# EAGLE design bazz_fuss (EAGLE 5.07)
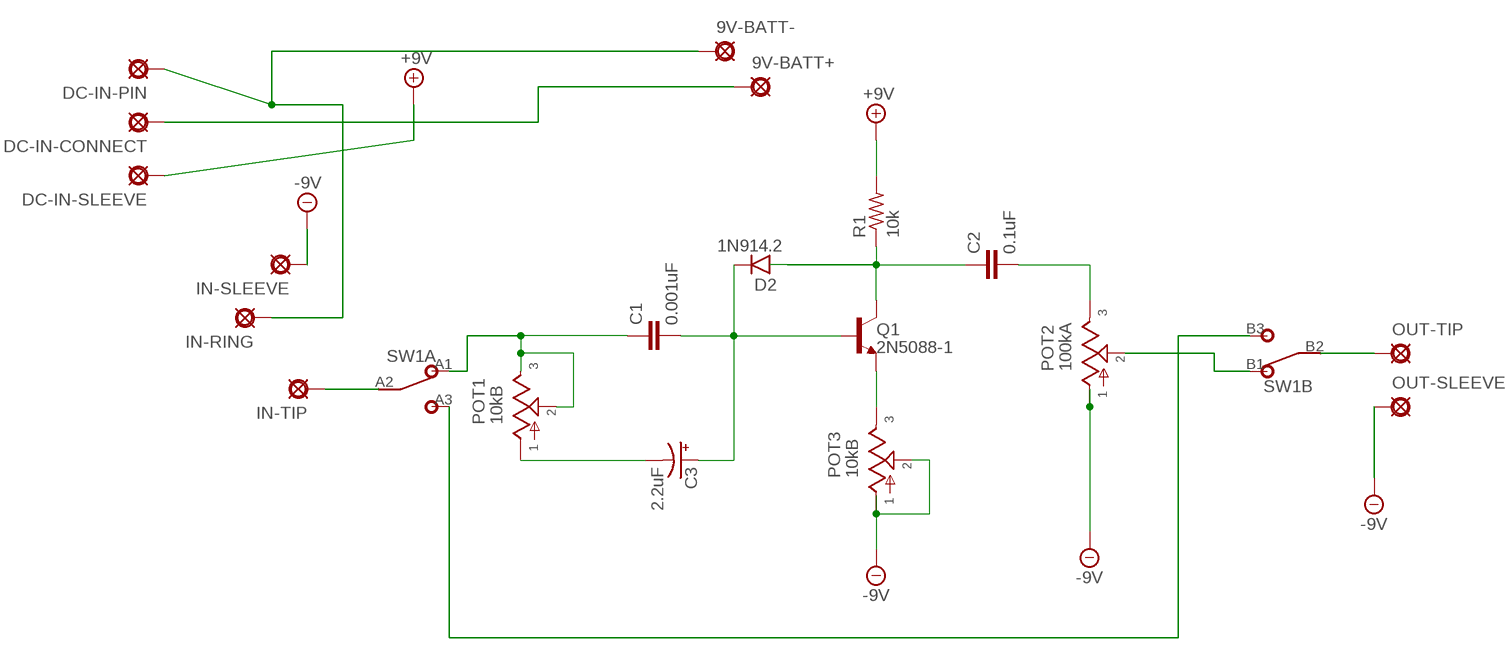
[diagram p0: schematic, sheet 1]

## Parts
9V-BATT+  PAD  [SQUARE]
9V-BATT-  PAD8  [OCTOGON]
C1  0.001uF  070X0302  [070X030]
C2  0.1uF  072X0252  [072X025]
C3  2.2uF  0502  [050_020_2]
D2  1N914.2  [DO35-2]
DC-IN-CONNECT  PAD  [SQUARE]
DC-IN-PIN  PAD8  [OCTOGON]
DC-IN-SLEEVE  PAD  [SQUARE]
IN-RING  PAD  [SQUARE]
IN-SLEEVE  PAD8  [OCTOGON]
IN-TIP  PAD  [SQUARE]
OUT-SLEEVE  PAD8  [OCTOGON]
OUT-TIP  PAD  [SQUARE]
POT1  10kB  POT  [POT]
POT2  100kA  POT  [POT]
POT3  10kB  POT  [POT]
Q1  2N5088-1  [TO92-]
R1  10k  3MM.3  [R0204/3]
SW1  DPDT  [DPDT]

## Nets
+9V: DC-IN-SLEEVE.1(PAD) R1.2
-9V: IN-SLEEVE.1(PAD) OUT-SLEEVE.1(PAD) POT2.1 POT3.1 POT3.2
N$2: C1.2 C3.+ D2.C Q1.2(B)
N$3: POT3.3 Q1.3(E)
N$4: POT2.2 SW1.B1
N$5: C1.1 POT1.2 POT1.3 SW1.A1
N$6: C3.- POT1.1
N$7: C2.2 POT2.3
N$8: IN-TIP.1(PAD) SW1.A2
N$11: 9V-BATT+.1(PAD) DC-IN-CONNECT.1(PAD)
N$12: OUT-TIP.1(PAD) SW1.B2
N$13: SW1.A3 SW1.B3
N$16: 9V-BATT-.1(PAD) DC-IN-PIN.1(PAD) IN-RING.1(PAD)
N$18: C2.1 D2.A Q1.1(C) R1.1

## Library data of the parts
9V-BATT+ 9V-BATT- DC-IN-CONNECT DC-IN-PIN DC-IN-SLEEVE IN-RING IN-SLEEVE IN-TIP OUT-SLEEVE OUT-TIP = gm-supply:PAD: PAD use this package for pads with any purpose, including input, output, send or return various pad shapes: round, square, octogonal, long, and long offset
C1 = gm-caps-film-chicklet:070X030: 0.0001 - .01uF (100 - 10,000pF) Panasonic ECQ-B 7mm x 3mm 50 or 63V: 0.0001 - .01uF (100 - 10,000pF);
C2 = gm-caps-film-box:072X025: 1000pF - 0.47uF WIMA MKP2 63, 100V: 1000pF - 0.015uF; MKS2 50V: 0.33 - 0.47uF; 63V: 1000pF - 0.22uF;
C3 = gm-caps-electro-pol:050: 0.22 - 100uF Xicon values at Mouser.com: 10V: 10 - 100uF; 16V: 2.2 - 47uF; 25V: 0.47 - 47uF; 50V: 0.22 - 22uF
D2 = gm-diodes:1N914: Fast Switching Diode DO-35 glass case a.k.a. 1N4148
POT1-POT3 = gm-pots:POT: Potentiometers the arrow indicates the clockwise motion of th wiper (lug 2) fully counter clockwise there is no resistance between lugs 1 and 2 fully clockwise the resistance between lugs 1 and 2 is the value of the pot
Q1 = gm-trans:2N5088: NPN Transistor
R1 = gm-resistors:3MM: 3mm Resistors Leads spaced 1-6 holes apart for 0.1" perfboard. Suitable for 1/8 watt resistors.
SW1 = gm-switches:DPDT

## Board
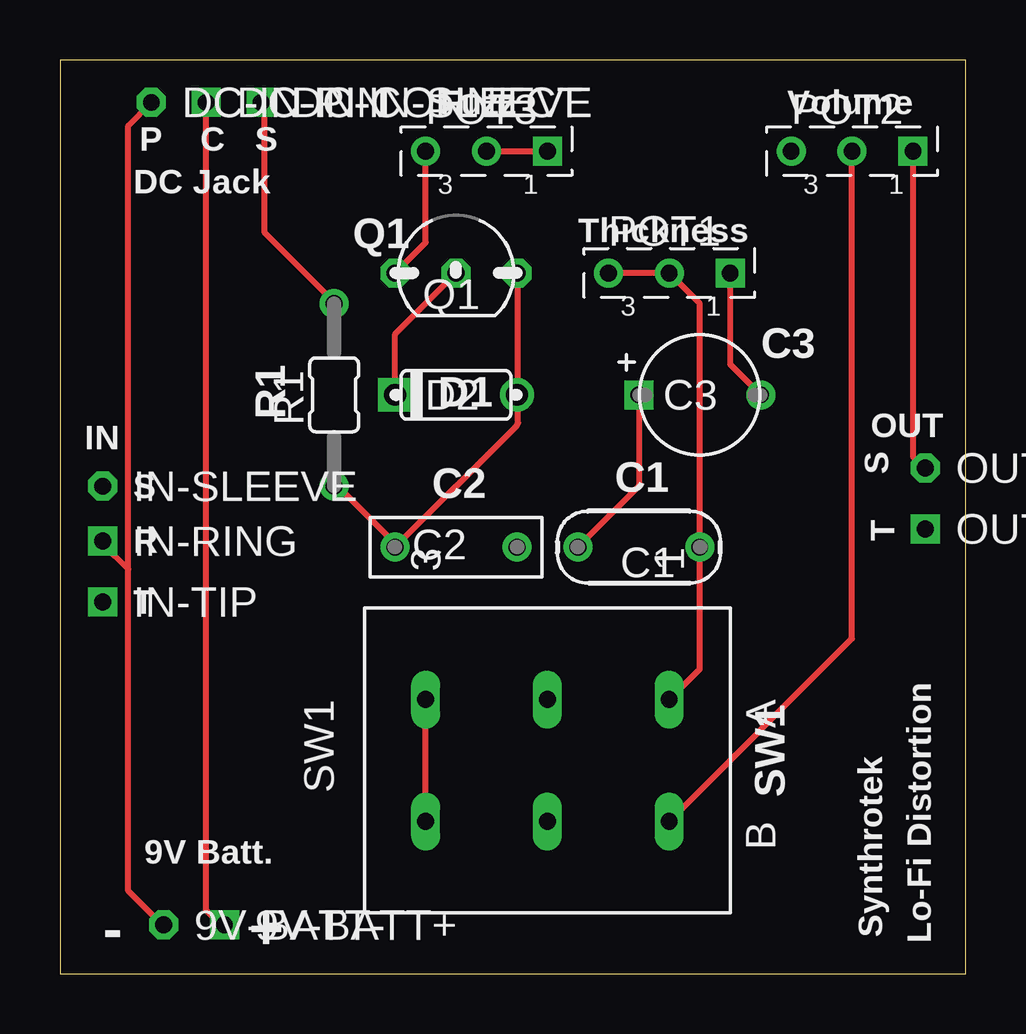
[diagram p1: board, top side]
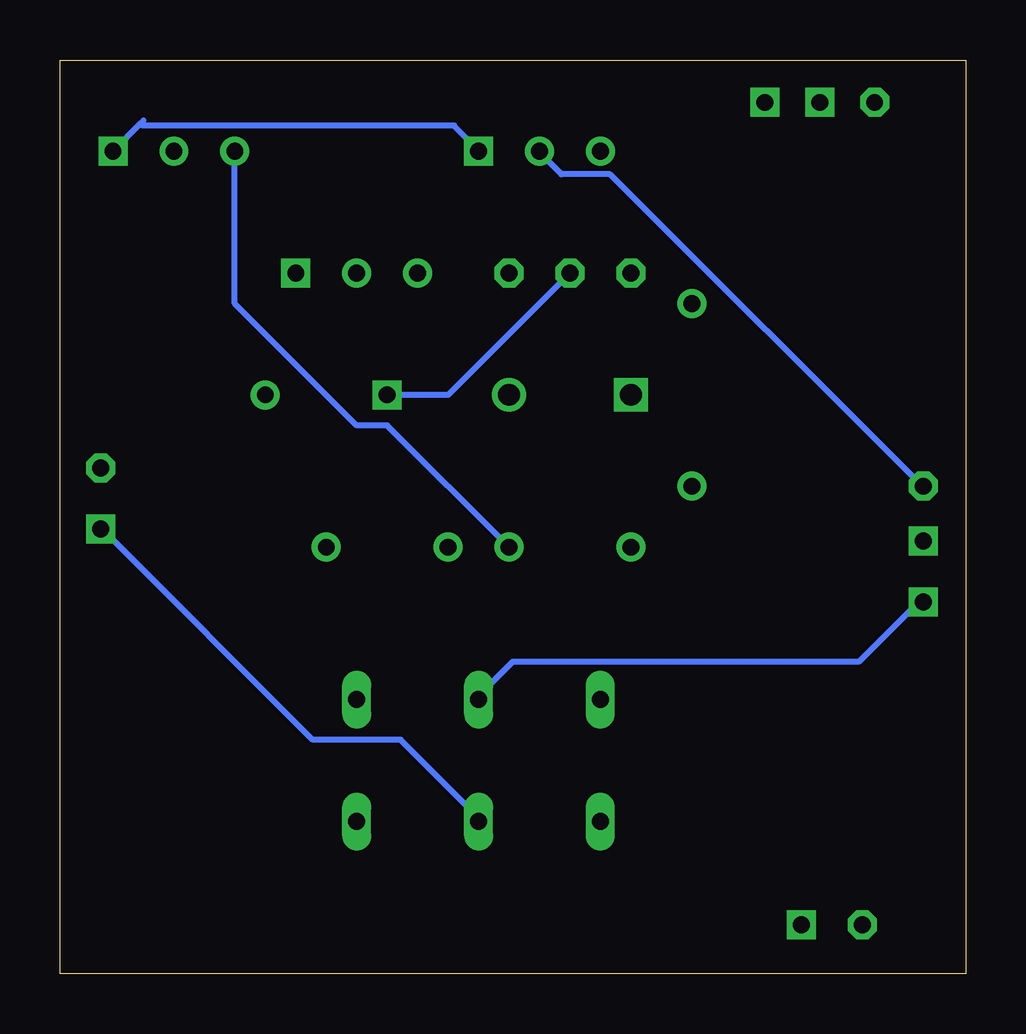
[diagram p2: board, bottom side, seen from below]

Size 37.77 x 38.09 mm. Coordinates in mm from the lower left corner, seen from the top.
Outline: 0,0 37.77,0 37.77,38.09 0,38.09 0,0
Copper layers (1*16): Top 0.035mm / dielectric 1.5mm / Bottom 0.035mm
Design rules "default": minimum track width 10mil, minimum drill 24mil, track to track 8mil, track to pad 8mil, pad to pad 8mil, via to via 8mil, smd to smd 8mil, copper to edge 40mil, drill to drill 8mil, minimum pad ring 10mil, minimum via ring 8mil, stop-mask expansion 4mil, vias tented up to drill 0mil, thermal gap 10mil

### Footprints (pad centres in the part's own frame; a part is rotated, then mirrored left to right if it is on the bottom)
SQUARE = drill 0.7 square: 1 0,0
OCTOGON = drill 0.7 octagon: 1 0,0
070X030 = drill 0.7 round: 1 -2.54,0; 2 2.54,0
072X025 = drill 0.7 round: 1 -2.54,0; 2 2.54,0
050_020_2 = drill 0.7 square: + -2.54,0 | drill 0.7 round: - 2.54,0
DO35-2 = drill 0.9 round: A 2.54,0 | drill 0.9 square: C -2.54,0
POT = drill 0.7 square: 1 2.54,0 | drill 0.7 round: 2 0,0; 3 -2.54,0
TO92- = drill 0.7 octagon: 1 2.54,0; 2 0,0; 3 -2.54,0
R0204/3 = drill 0.7 round: 1 -3.81,0; 2 3.81,0
DPDT = drill 0.7 long: A1 -2.54,5.08; A2 -2.54,0; A3 -2.54,-5.08; B1 2.54,5.08; B2 2.54,0; B3 2.54,-5.08

### Placement (x,y rotation side)
9V-BATT+  6.86,2.03 0 top
9V-BATT-  4.32,2.03 0 top
C1  24.13,17.78 180 top
C2  16.51,17.78 0 top
C3  26.67,24.13 0 top
D2  16.51,24.13 0 top
DC-IN-CONNECT  6.1,36.32 0 top
DC-IN-PIN  3.81,36.32 0 top
DC-IN-SLEEVE  8.38,36.32 0 top
IN-RING  1.78,18.03 0 top
IN-SLEEVE  1.78,20.32 0 top
IN-TIP  1.78,15.49 0 top
OUT-SLEEVE  36.07,21.08 0 top
OUT-TIP  36.07,18.54 0 top
POT1  25.4,29.21 0 top
POT2  33.02,34.29 0 top
POT3  17.78,34.29 0 top
Q1  16.51,29.21 0 top
R1  11.43,24.13 90 top
SW1  20.32,8.89 270 top

### Tracks (layer width: path | path; a pad name or v marks a point on that pad's centre or on a via)
+9V
  Top 0.254: R1.2 11.38,28.04 8.53,30.89 8.53,36.17 DC-IN-SLEEVE.1
-9V
  Top 0.254: POT3.2 POT3.1 | OUT-SLEEVE.1 35.97,21.13 35.56,21.54 POT2.1
  Bottom 0.254: 34.42,35.43 POT2.1 | 34.42,35.43 34.29,35.56 | IN-SLEEVE.1 1.83,20.32 14.83,33.33 16.87,33.33 17.68,34.14 POT3.2 | 34.42,35.43 34.34,35.36 21.34,35.36 20.32,34.34 POT3.1
N$2
  Top 0.254: Q1.2 13.97,26.67 D2.C | C1.2 24.13,20.32 C3.+
  Bottom 0.254: Q1.2 21.59,24.13 C3.+
N$3
  Top 0.254: Q1.3 15.24,30.48 POT3.3
N$4
  Top 0.254: SW1.B1 33.02,13.97 POT2.2
N$5
  Top 0.254: POT1.3 POT1.2 26.67,27.94 C1.1 26.67,12.7 SW1.A1
N$6
  Top 0.254: C3.- 27.94,25.4 POT1.1
N$7
  Bottom 0.254: C2.2 24.13,22.86 25.4,22.86 30.48,27.94 POT2.3
N$8
  Bottom 0.254: IN-TIP.1 1.83,15.65 4.47,13.01 18.9,13.01 20.32,11.58 SW1.A2
N$11
  Top 0.254: 9V-BATT+.1 6.71,2.03 6.1,2.64 DC-IN-CONNECT.1
N$12
  Bottom 0.254: SW1.B2 20.32,6.5 23.57,9.75 27.23,9.75 35.97,18.49 OUT-TIP.1
N$13
  Top 0.254: SW1.B3 SW1.A3
N$16
  Top 0.254: 2.85,16.87 2.85,3.45 4.27,2.03 9V-BATT-.1 | 2.85,16.87 1.83,17.88 IN-RING.1 | 2.85,16.87 2.85,35.36 DC-IN-PIN.1
N$18
  Top 0.254: R1.1 11.58,20.32 13.82,18.09 13.82,17.88 C2.1 19.05,22.86 19.1,22.96 19.1,23.98 D2.A 19.1,24.18 19.1,29.06 Q1.1

### Text on the board
tPlace: Fuzz | Volume | P | C | S | DC Jack | Q1 | Thickness | C3 | D1 | R1 | OUT | IN | S | S | C2 | C1 | R | T | T | SW1 | 9V Batt. | Synthrotek | - | + | Lo-Fi Distortion